# EAGLE design remote_control_board (EAGLE 9.0.0)
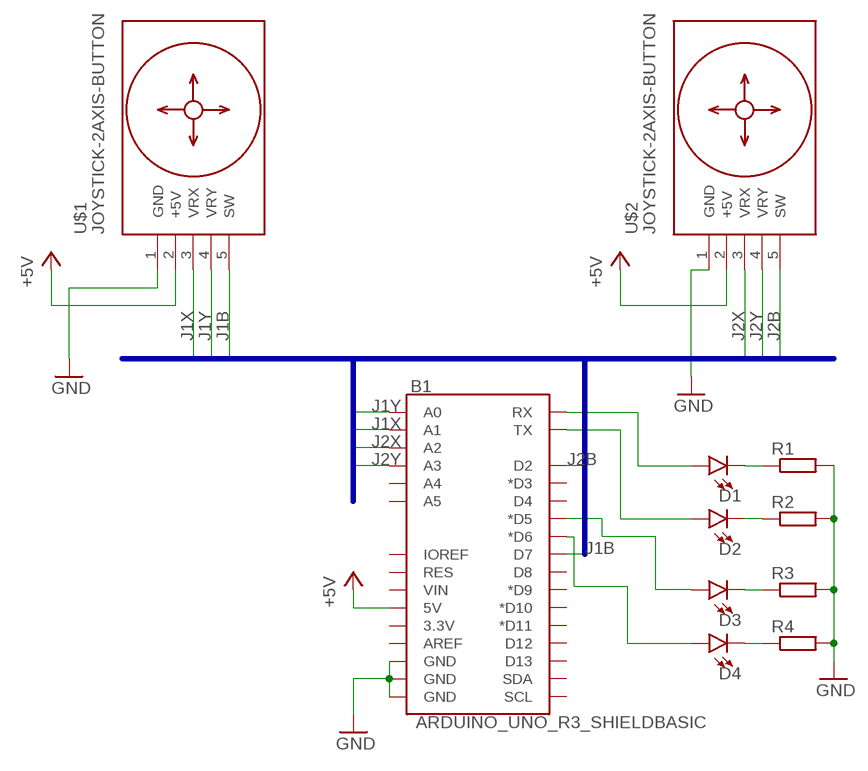
[diagram p0: schematic, sheet 1]

## Parts
B1  ARDUINO_UNO_R3_SHIELDBASIC  [UNO_R3_SHIELD]
D1  LED5MM  [LED_5MM]
D2  LED5MM  [LED_5MM]
D3  LED5MM  [LED_5MM]
D4  LED5MM  [LED_5MM]
R1  R-EU_0204/7  [0204/7]
R2  R-EU_0204/7  [0204/7]
R3  R-EU_0204/7  [0204/7]
R4  R-EU_0204/7  [0204/7]
U$1  JOYSTICK-2AXIS-BUTTON  [JOYSTICK-2AXIS-BUTTON]
U$2  JOYSTICK-2AXIS-BUTTON  [JOYSTICK-2AXIS-BUTTON]

## Nets
+5V: B1.5V U$1.2(+5V) U$2.2(+5V)
GND: B1.GND@0(GND) B1.GND@2(GND) R1.2 R2.2 R3.2 R4.2 U$1.1(GND) U$2.1(GND)
J1B: B1.D7 U$1.5(SW)
J1X: B1.A1 U$1.3(VRX)
J1Y: B1.A0 U$1.4(VRY)
J2B: B1.D2 U$2.5(SW)
J2X: B1.A2 U$2.3(VRX)
J2Y: B1.A3 U$2.4(VRY)
N$1: B1.RX D1.A
N$2: B1.TX D2.A
N$3: D1.K(C) R1.1
N$4: D2.K(C) R2.1
N$5: D3.K(C) R3.1
N$6: D4.K(C) R4.1
N$8: B1.D5(*D5) D3.A
N$9: B1.D6(*D6) D4.A
Unconnected: B1.3.3V B1.A4 B1.A5 B1.AREF B1.D3(*D3) B1.D4 B1.D8 B1.D9(*D9) B1.D10(*D10) B1.D11(*D11) B1.D12 B1.D13 B1.GND@1(GND) B1.IOREF B1.RES B1.SCL B1.SDA B1.VIN

## Buses
J1B,J1X,J1Y,J2B,J2X,J2Y

## Library data of the parts
B1 = SparkFun-Boards:ARDUINO_UNO_R3_SHIELD: Arduino R3 Shield Footprint Shield form compatible with the Arduino Uno R3. SparkFun Products: MG2639 Cellular Shield <https://www.sparkfun.com/products/13120> MIDI Shield <https://www.sparkfun.com/products/12898> R3 Stackable Headers Kit <https://www.sparkfun.com/products/11417>
D1-D4 = SparkFun-LED:LED: LED (Generic) Standard schematic elements and footprints for 5mm, 3mm, 1206, and 0603 sized LEDs. Generic LEDs with no color specified.
R1-R4 = resistor:R-EU_: RESISTOR, European symbol
U$1 U$2 = diy-modules:JOYSTICK-2AXIS-BUTTON: 2-Axis Analog Joystick with Push Button Tutorial is available here: http://henrysbench.capnfatz.com/henrys-bench/arduino-sensors-and-input/arduino-ps2-joystick-tutorial-keyes-ky-023-deek-robot/ Click here to find device on ebay.com <http://www.ebay.com/sch/joystick+ps2+module>

## Board
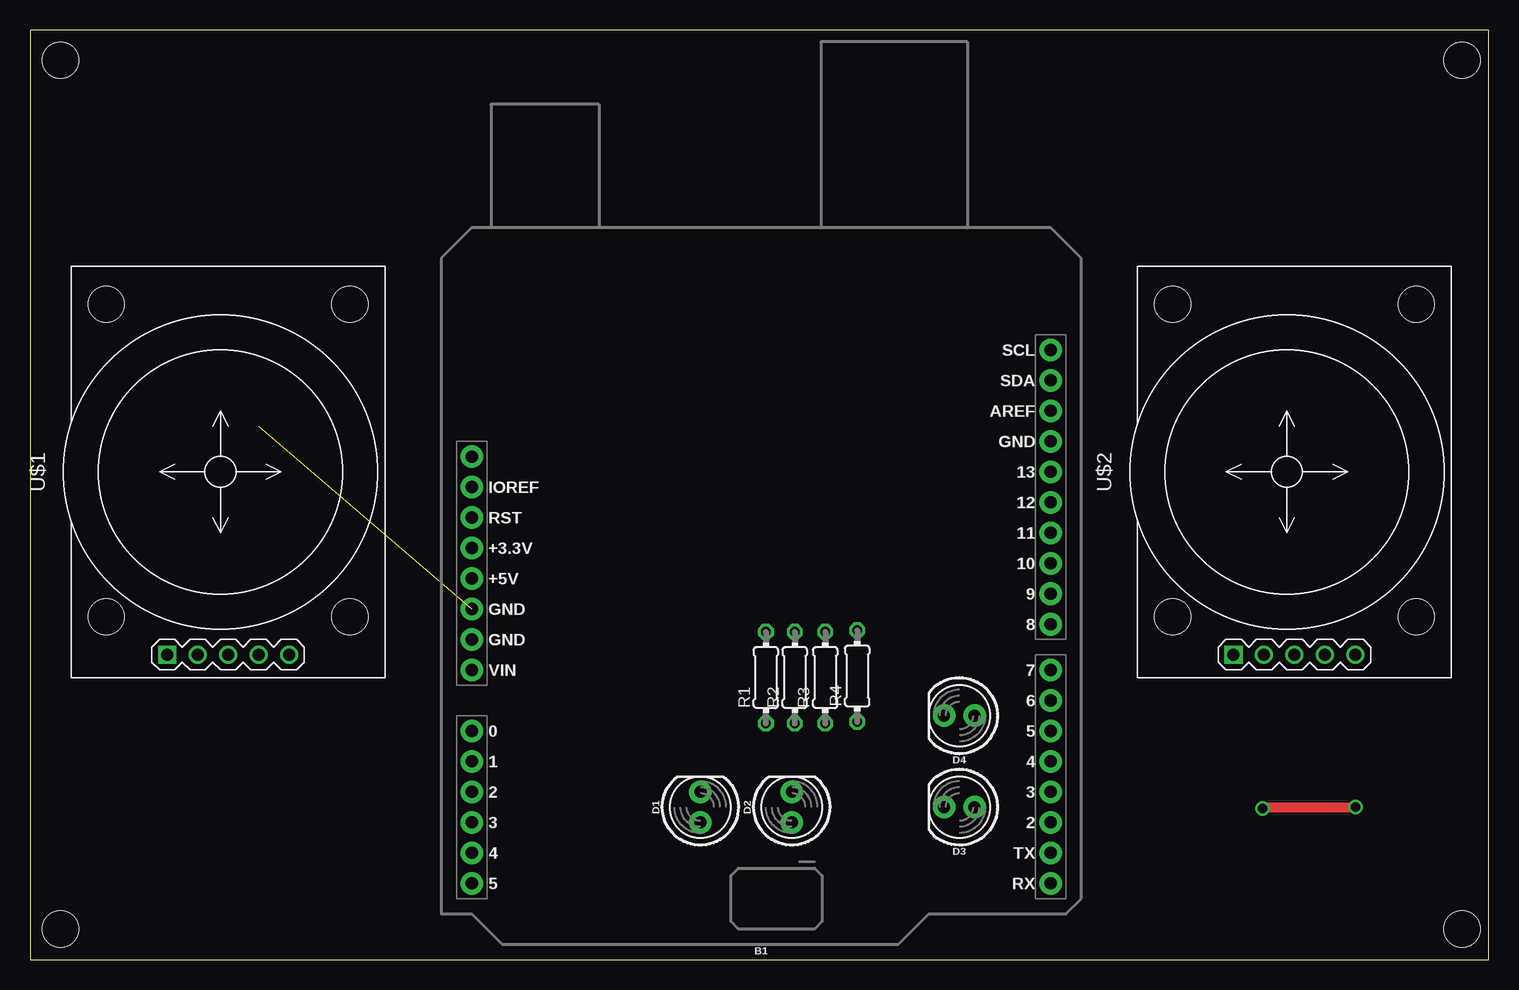
[diagram p1: board, top side]
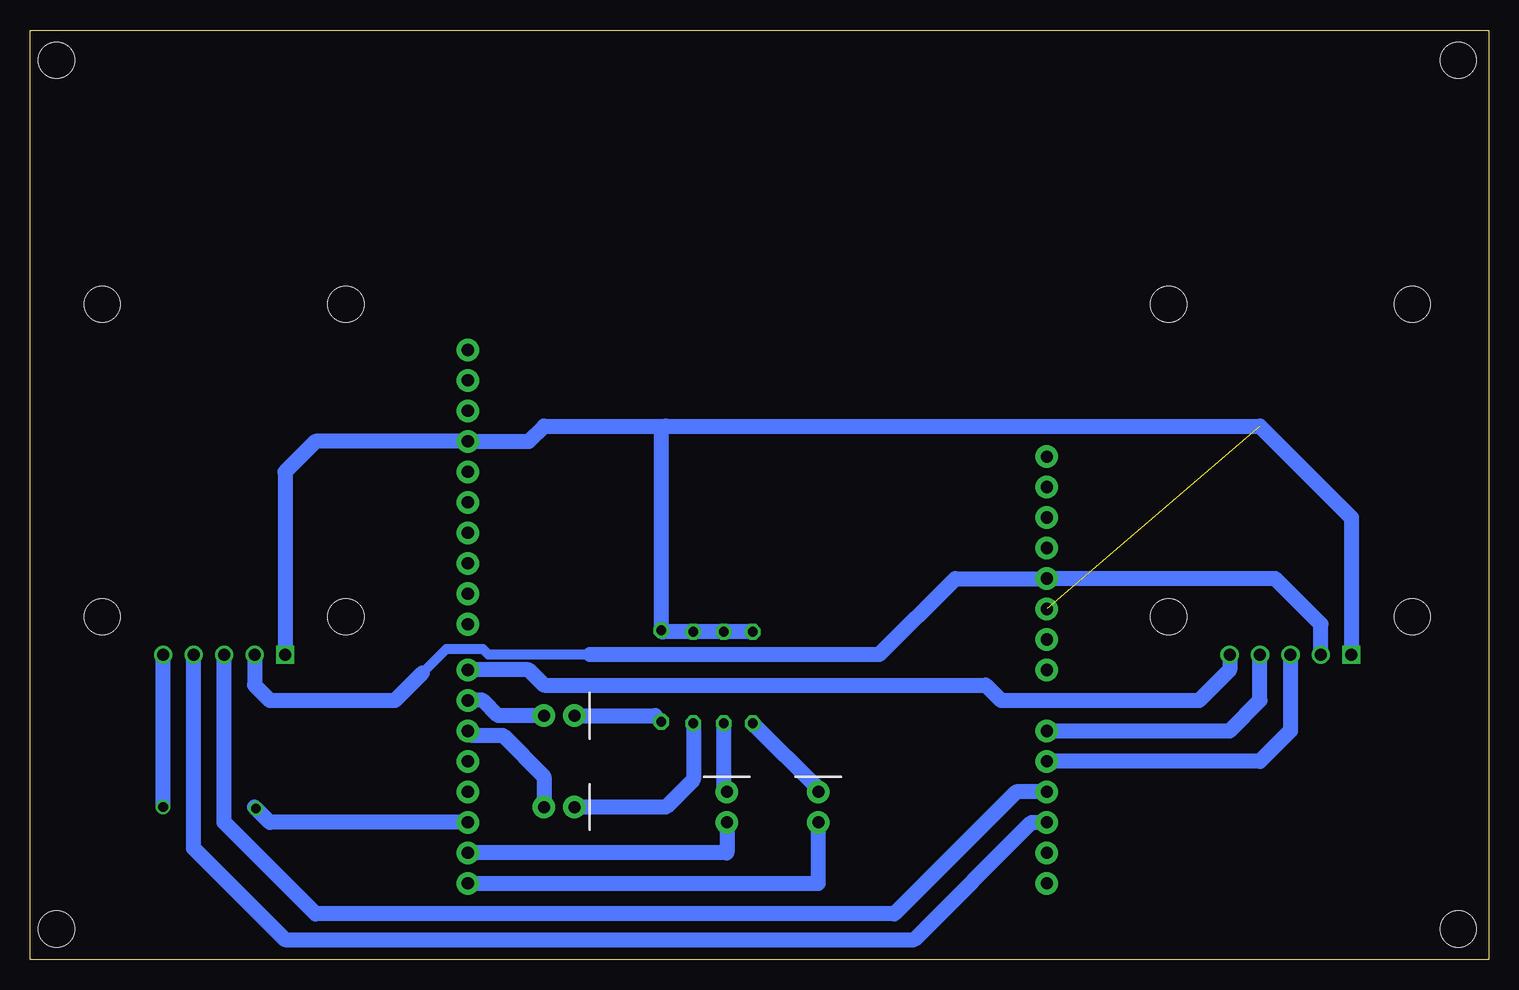
[diagram p2: board, bottom side, seen from below]

Size 121.59 x 77.46 mm. Coordinates in mm from the lower left corner, seen from the top.
Outline: 0,0 121.59,0 121.59,77.46 0,77.46 0,0
Copper layers (1*16): Top 0.035mm / dielectric 1.5mm / Bottom 0.035mm
Design rules "default": minimum track width 6mil, minimum drill 0.35mm, track to track 6mil, track to pad 6mil, pad to pad 6mil, via to via 6mil, smd to smd 6mil, copper to edge 40mil, drill to drill 6mil, minimum pad ring 10mil, minimum via ring 8mil, stop-mask expansion 4mil, vias tented up to drill 0mil, thermal gap 10mil
Holes 3 mm at 2.54,74.93 2.54,2.54 119.38,2.54 119.38,74.93

### Footprints (pad centres in the part's own frame; a part is rotated, then mirrored left to right if it is on the bottom)
UNO_R3_SHIELD = drill 1.016 pad 1.88: 3.3V 24.13,-2.54; 5V 24.13,0; A0 24.13,12.7; A1 24.13,15.24; A2 24.13,17.78; A3 24.13,20.32; A4 24.13,22.86; A5 24.13,25.4; AREF -24.13,-13.97; D2 -24.13,20.32; D3 -24.13,17.78; D4 -24.13,15.24; D5 -24.13,12.7; D6 -24.13,10.16; D7 -24.13,7.62; D8 -24.13,3.81; D9 -24.13,1.27; D10 -24.13,-1.27; D11 -24.13,-3.81; D12 -24.13,-6.35; D13 -24.13,-8.89; GND@0 24.13,2.54; GND@1 24.13,5.08; GND@2 -24.13,-11.43; IOREF 24.13,-7.62; NC 24.13,-10.16; RES 24.13,-5.08; RX -24.13,25.4; SCL -24.13,-19.05; SDA -24.13,-16.51; TX -24.13,22.86; VIN 24.13,7.62
LED_5MM = drill 1 pad 1.88: A -1.27,0; K 1.27,0
0204/7 = drill 0.813 octagon: 1 -3.81,0; 2 3.81,0
JOYSTICK-2AXIS-BUTTON = drill 1 square: 1 -15.24,5.08 | drill 1: 2 -15.24,2.54; 3 -15.24,0; 4 -15.24,-2.54; 5 -15.24,-5.08 | hole 3: -12.065,10.16; -12.065,-10.16; 13.97,-10.16; 13.97,10.16

### Placement (x,y rotation side)
B1  60.96,31.75 180 top
D1  55.88,12.7 90 top
D2  63.5,12.7 90 top
D3  77.47,12.7 180 top
D4  77.47,20.32 180 top
R1  61.34,23.5 90 top
R2  63.75,23.5 90 top
R3  66.29,23.5 90 top
R4  68.96,23.62 90 top
U$1  16.51,40.64 90 top
U$2  105.41,40.64 90 top

### Tracks (layer width: path | path; a pad name or v marks a point on that pad's centre or on a via)
+5V
  Bottom 0.813: 88.9,23.86 86.9,25.86 83.82,25.86 83.36,25.4 74.93,25.4
  Bottom 1.27: U$1.2 13.97,27.94 17.78,31.75 B1.5V 44.45,31.75 50.8,25.4 74.93,25.4 | 88.9,23.86 91.17,21.59 101.6,21.59 102.87,22.86 U$2.2
GND  (1 unrouted)
  Bottom 1.27: U$2.1 100.33,40.64 97.79,43.18 B1.GND@2 80.01,43.18 78.74,44.45 68.58,44.45 | 68.58,44.45 19.05,44.45 11.43,36.83 U$1.1 | R1.2 R2.2 R3.2 68.83,27.3 R4.2 68.96,44.07 68.58,44.45
J1B
  Bottom 1.27: U$1.5 21.59,24.13 24.13,21.59 40.64,21.59 41.91,22.86 78.74,22.86 80.01,24.13 B1.D7
J1X
  Bottom 1.27: U$1.3 16.51,19.05 19.05,16.51 B1.A1
J1Y
  Bottom 1.27: B1.A0 21.59,19.05 19.05,21.59 U$1.4
J2B  (via drill 0.8)
  Top 0.813: v102.74,12.57 102.87,12.7 v110.49,12.7
  Bottom 1.27: B1.D2 101.6,11.43 v102.74,12.57 102.87,12.7 | v110.49,12.7 U$2.5
J2X
  Bottom 1.27: B1.A2 39.37,13.97 49.53,3.81 97.79,3.81 105.41,11.43 U$2.3
J2Y
  Bottom 1.27: U$2.4 107.95,9.27 100.33,1.65 47.88,1.65 38.1,11.43 B1.A3
N$1
  Bottom 1.27: D1.A 55.88,6.35 B1.RX
N$2
  Bottom 1.27: D2.A 63.5,8.89 B1.TX
N$3
  Bottom 1.27: R1.1 55.88,14.22 D1.K
N$4
  Bottom 1.27: D2.K 63.75,14.22 R2.1
N$5
  Bottom 1.27: D3.K 68.58,12.7 66.29,14.99 R3.1
N$6
  Bottom 1.27: D4.K 69.47,20.32 R4.1
N$8
  Bottom 1.27: B1.D5 84.71,18.67 82.17,18.67 78.74,15.24 D3.A
N$9
  Bottom 1.27: D4.A 82.55,20.32 83.82,21.59 B1.D6